# Altium schematic sheet VREG.SchDoc
size A
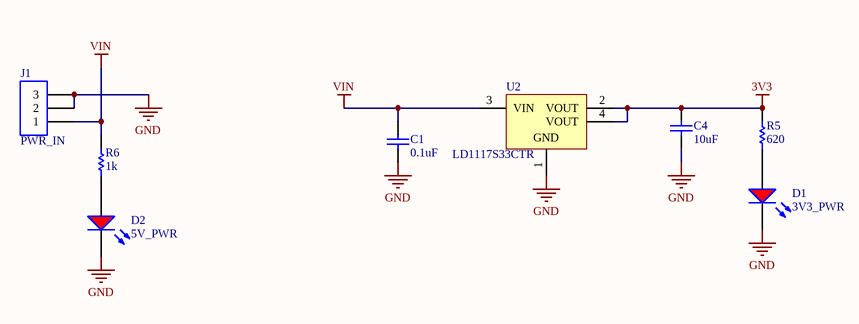
[diagram p0: VREG.SchDoc]

## Parts
C1  0.1uF  [PCB-5bhg8adqnzhgtf4b63gj-1]
C4  10uF  [PCB-19299738-1]
D1  3V3_PWR  [KING-LED0603-25-RED_V]
D2  5V_PWR  [KING-LED0603-25-RED_V]
J1  PWR_IN  [ADAM-ADC-002-3_V]
R5  620  [RESC1005X40X25NL05T05]
R6  1k  [RESC1005X40X25NL05T05]
U2  LD1117S33CTR  [SOT-223_N]

## Nets
3V3: C4.2 R5.2 U2.2(VOUT) U2.4(VOUT)
GND: C1.1 C4.1 D1.2(C) D2.2(C) J1.2 J1.3 U2.1(GND)
VIN: C1.2 J1.1 R6.2 U2.3(VIN)
NetD1_1: D1.1(A) R5.1
NetD2_1: D2.1(A) R6.1

## Library data of the parts
C1 = CMP-76b0bfb95be4a977-1: 0402 0.1 uF 25 V ±10% Tolerance X5R SMT Multilayer Ceramic Capacitor; Manufacturer Part Number: TMK105BJ104KV-F; Lead-Free Status: Lead Free; Capacitance: 100 nF; Voltage Rating (DC): 25.0 V; Size-Length: 1.00 mm; Octopart URL: https://octopart.com/tmk105bj104kv-f-taiyo+yuden-198706; OctopartID: 76b0bfb95be4a977; RoHS: Compliant; Size-Height: 500 µm; REACH SVHC Compliance: No SVHC; Capacitance Tolerance: ±10%; Dielectric Characteristic: X5R; Packaging: Cut Tape (CT), Tape & Reel (TR); Operating Temperature: -55.0 °C to 85.0 °C; Case/Package: 0402; Mounting Style: Surface Mount; Size-Width: 500 µm; Halogen Free Status: Halogen Free; Lifecycle Status: Active; Number of Pins: 2
C4 = CMP-19299738-2: CAP CER 10UF 10V 10% X5R 0805; Manufacturer Part Number: GRM21BR61A106KE19L; Capacitance: 1e-05 F; Case/Package (SI): 2012; Lead-Free Status: Lead Free; Voltage Rating (DC): 10.0 V; Capacitance Tolerance: ±10%; Dielectric Characteristic: X5R; Lifecycle Status: Active; Mounting Style: Surface Mount; Number of Pins: 2; Octopart Url: https://octopart.com/grm21br61a106ke19l-murata-196422; OctopartID: ff26362e250620e1; Packaging: Cut Tape (CT); REACH SVHC Compliance: No SVHC; RoHS: Compliant; Size-Height: 0.00125 m; Size-Length: 0.002 m; Size-Thickness: 0.00125 m; Size-Width: 0.00125 m
D1 D2 = CMP-20cce8f01131ff0b-3: 1.6 x 0.8 x 0.4 mm (0603) Red 120º Min 11.5mcd Max 28.5mcd SMT LED; Manufacturer Part Number: 19-217/R6C-AL1M2VY/3T; RoHS: Compliant; OctopartID: 20cce8f01131ff0b; Seller Landing  Url: https://octopart-clicks.com/click/track?country=US&ak=8157f166&sig=0e63595&sid=2454&ppid=20321435&vpid=57003316&ct=offers
J1 = CMP-3153101-9: DC Power Connectors DC POWER JACK 2.5MM PIN TYPE 002; Manufacturer Part Number: ADC-002-2; Octopart Url: https://octopart.com/adc-002-2-adam+tech-55509430; OctopartID: 975d5d18b38d489a; Orientation: Right Angle
R5 = CMP-3676372-2: Thick Film Resistors - SMD 0402 620ohms 5% Tol; Manufacturer Part Number: ERJ-2GEJ621X; Lead-Free Status: Lead Free; Power Rating: 0.1 W; Resistance: 620.0 Ω; Voltage Rating (DC): 50.0 V; Case/Package: 0402; Lifecycle Status: Not Listed by Manufacturer; Mounting Style: Surface Mount; Octopart Url: https://octopart.com/erj-2gej621x-panasonic-55420795; OctopartID: 363cfc7bb421e9fb; Packaging: Cut Tape (CT); REACH SVHC Compliance: No SVHC; Resistance Tolerance: ±5%; RoHS: Compliant; Size-Height: 0.00035 m; Size-Length: 0.001 m; Size-Width: 0.0005 m
R6 = CMP-1903935-2: RES SMD 1K OHM 5% 1/16W 0402; Manufacturer Part Number: CRCW04021K00JNTD; Lead-Free Status: Contains Lead; Power Rating: 0.063 W; Resistance: 1000.0 Ω; Voltage Rating (DC): 50.0 V; Case/Package: 0402; Mounting Style: Surface Mount; Number of Pins: 2; Octopart Url: https://octopart.com/crcw04021k00jntd-vishay+dale-39408639; OctopartID: 1db5d6e66b2cc272; Resistance Tolerance: ±5%; RoHS: Non-Compliant; Size-Height: 0.00035 m; Size-Length: 0.001 m; Size-Width: 0.0005 m
U2 = CMP-1170392-2: Fixed Low Drop Positive Voltage Regulator, 3.3V, 4-Pin SOT-223, Tape and Reel; Dropout Voltage: 1.1 V; Lead-Free Status: Lead Free; Number of Outputs: 1; Case/Package: SOT-223; Lifecycle Status: Active; Mounting Style: Surface Mount; Number of Pins: 3; Octopart Url: https://octopart.com/ld1117s33ctr-stmicroelectronics-526725; OctopartID: 0754ce562bb7d893; Output Voltage: 3.3 V; REACH SVHC Compliance: No SVHC; RoHS: Compliant; Manufacturer Part Number: LD1117S33CTR